# Altium schematic sheet Secondary_Display.SchDoc
size A; SheetNumber: 2; SheetTotal: 2
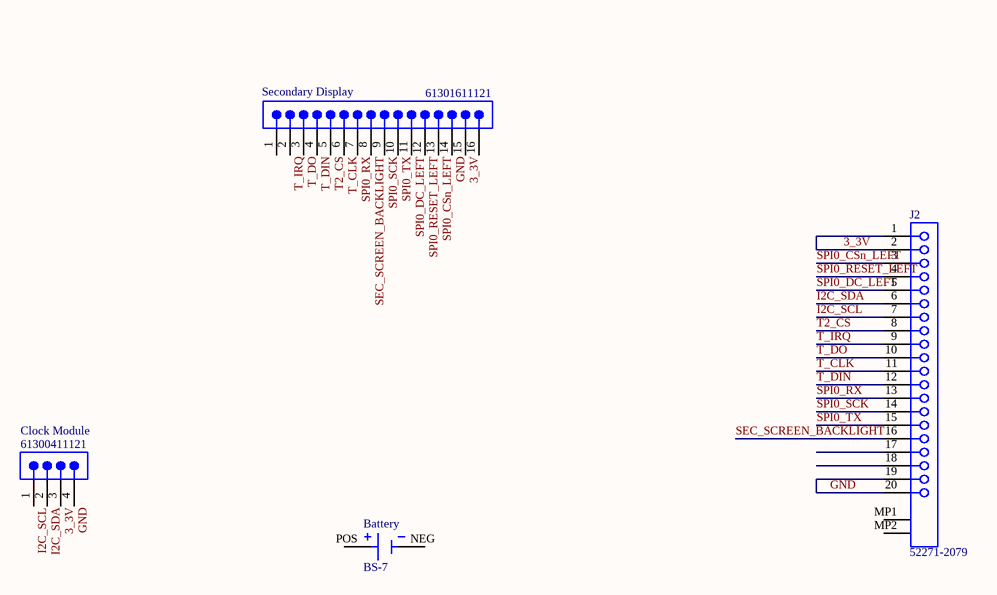
[diagram p0: Secondary_Display.SchDoc]

## Parts
Battery  BS-7  [BAT_BS-7]
Clock_Module  61300411121  [61300411121]
J2  52271-2079  [MOLX-52271-2079]
Secondary_Display  61301611121  [61301611121]

## Nets
3_3V: Clock_Module.3 J2.1 J2.2 Secondary_Display.15
GND: Clock_Module.4 J2.19 J2.20 Secondary_Display.14
I2C_SCL: Clock_Module.1 J2.7
I2C_SDA: Clock_Module.2 J2.6
SEC_SCREEN_BACKLIGHT: J2.16 Secondary_Display.8
SPI0_CSn_LEFT: J2.3 Secondary_Display.13
SPI0_DC_LEFT: J2.5 Secondary_Display.11
SPI0_RESET_LEFT: J2.4 Secondary_Display.12
SPI0_RX: J2.13 Secondary_Display.7
SPI0_SCK: J2.14 Secondary_Display.9
SPI0_TX: J2.15 Secondary_Display.10
T2_CS: J2.8 Secondary_Display.5
T_CLK: J2.11 Secondary_Display.6
T_DIN: J2.12 Secondary_Display.4
T_DO: J2.10 Secondary_Display.3
T_IRQ: J2.9 Secondary_Display.2

Not connected (* = marked no-connect by the designer): Battery NEG POS; J2 17 18 MP1 MP2; Secondary_Display 1 16

## Library data of the parts
Battery = BS-7: Battery Holder (Open) Coin, 20.0mm 1 Cell PC Pin; MF: MPD (Memory; SnapEDA_Link: https://www.snapeda.com/parts/BS-7/MPD+%2528Memory+Protection+Devices%2529/view-part/?ref=snap; Package: None; MP: BS-7; Check_prices: https://www.snapeda.com/parts/BS-7/MPD+%2528Memory+Protection+Devices%2529/view-part/?ref=eda; Purchase-URL: https://pricing.snapeda.com/search/part/BS-7/?ref=eda; Digi-Key_Part_Number: BS-7-ND; Value: *; ComponentLink1Description: https://www.digikey.com/en/products/detail/mpd-memory-protection-devices/BS-7/389447; ComponentLink1URL: *
Clock_Module = CMP-1502-01064-3: NexarPartId: 32855522; Operating Supply Voltage: 250V; Pitch: 2.54mm; Contact Resistance: 20mΩ; Number of Positions: 4; Current Rating: 3A; Connector Type: Male Pin; Gender: Male; Contact Plating: Gold; Height: 8.89mm; Lead Pitch: 2.54mm; Lead Free: Lead Free; Contact Mating Length: 5.9944mm; Number of Rows: 1; Termination: Solder; Packaging: Bulk; REACH SVHC: Unknown; Min Operating Temperature: -40°C; RoHS: Compliant; Number of Contacts: 4; Voltage Rating: 250V; Color: Black; Max Operating Temperature: 105°C; Contact Material: Copper; Mount: Through Hole; Orientation: Vertical; Number of Pins: 4
J2 = CMP-1241-00254-1: 1.0 mm Pitch Easy-On(TM) Type FPC Connector, 3.0 mm Mated Height, Right Angle, ZIF, SMT, Bottom Contact, 20 Circuits, -40 to 85 degC, ELV and RoHS Compliant, Tape and Reel; Manufacturer: Molex; Material - Metal: Phosphor Bronze; Voltage (Max): 50V AC (RMS)/DC; PCB Retention: Yes; Pitch - Termination Interface: 1.00mm; Mated Height: 3.00mm; Circuits (Loaded): 20; Stackable: No; Material - Plating Mating: Tin-Bismuth; Current (Max per Contact): 0.5A; Entry Angle: 90degrees Angle; Durability (mating cycles max): 30; Contact Position: Bottom; ComponentLink1URL: http://www.molex.com/molex/index.jsp; Packing: Tape and Reel; ComponentLink2URL: http://www.molex.com/webdocs/datasheets/pdf/en-us/0522712079_FFC_FPC_CONNECTORS.pdf; PackageVersion: Rev. B, 04/2004; ComponentLink3Description: Package Specification; ComponentLink3URL: http://www.molex.com/pdm_docs/sd/522712079_sd.pdf; Number of Rows: 1; PartNumber: 52271-2079; ComponentLink2Description: Datasheet; PackageDescription: 20-Lead FPC Connector, Pitch 1.0 mm; Mounting Technology: Surface Mount; Polarized to PCB: Yes; PackageReference: 52271-2079; Pitch - Mating Interface: 1.00mm; ComponentLink1Description: Manufacturer URL; Orientation: Right Angle; RoHS: TRUE; PCB Locator: No; Material - Plating Termination: Tin-Bismuth
Secondary_Display = CMP-1502-01095-4: NexarPartId: 32855548; Voltage Rating: 250V; Connector Type: Male Pin; Current Rating: 3A; Contact Resistance: 20mΩ; Number of Contacts: 16; Gender: Male; Pitch: 2.54mm; Min Operating Temperature: -40°C; Termination: Solder; Height: 8.89mm; Contact Plating: Gold; Packaging: Bulk; Contact Material: Copper; Mount: Through Hole; Number of Rows: 1; Contact Mating Length: 5.9944mm; Operating Supply Voltage: 250V; RoHS: Compliant; Max Operating Temperature: 105°C; Lead Pitch: 2.54mm; Color: Black; Number of Pins: 16; Number of Positions: 16; REACH SVHC: Unknown; Orientation: Vertical